# Altium schematic sheet SDram.SchDoc
size A4; Organization: Altium Limited; Address1: L3, 12a Rodborough Rd; Address2: Frenchs Forest; Address3: NSW; Address4: Australia 2086
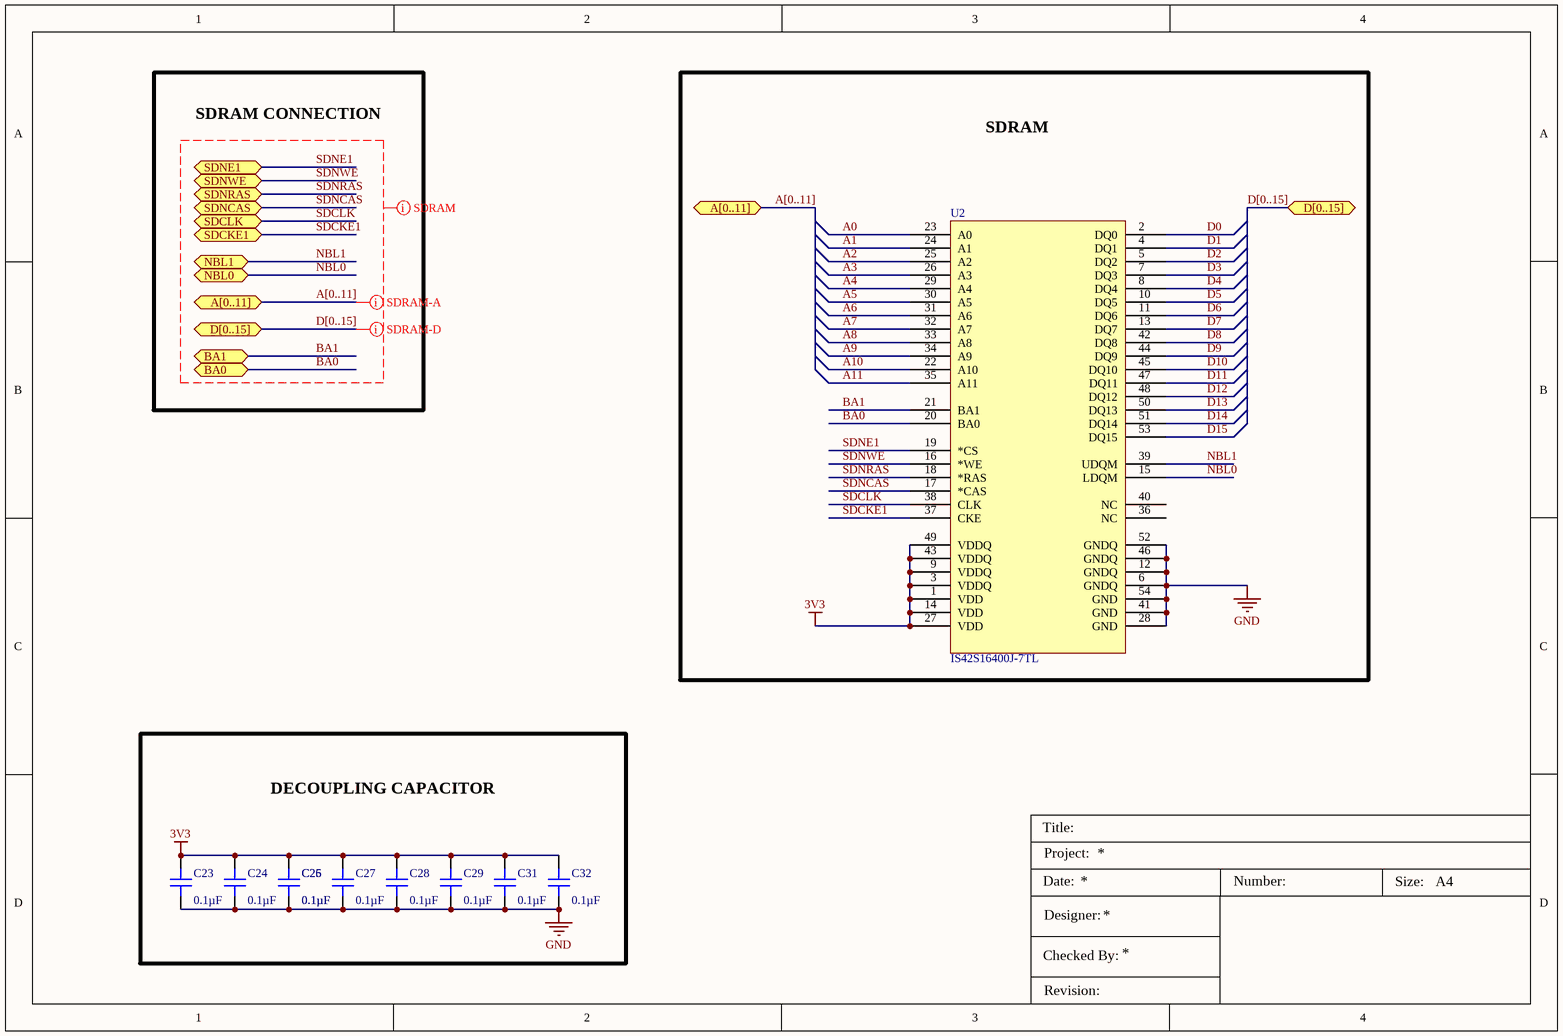
[diagram p0: SDram.SchDoc]

## Parts
C23  0.1µF  [CAP 0603_1608]
C24  0.1µF  [CAP 0603_1608]
C25  0.1µF  [CAP 0603_1608]
C26  0.1µF  [CAP 0603_1608]
C27  0.1µF  [CAP 0603_1608]
C28  0.1µF  [CAP 0603_1608]
C29  0.1µF  [CAP 0603_1608]
C31  0.1µF  [CAP 0603_1608]
C32  0.1µF  [CAP 0603_1608]
U2  IS42S16400J-7TL  [sdram]

## Blocks framed on the sheet
SDRAM: U2
DECOUPLING CAPACITOR: C23-C29 C31 C32

## Ports
A[0..11] (bidir), BA0 (bidir), BA1 (bidir), D[0..15] (bidir), NBL0 (bidir), NBL1 (bidir), SDCKE1 (bidir), SDCLK (bidir), SDNCAS (bidir), SDNE1 (bidir), SDNRAS (bidir), SDNWE (bidir)

## Nets
3V3: C23.2 C24.2 C25.2 C26.2 C27.2 C28.2 C29.2 C31.2 C32.2 U2.1(VDD) U2.3(VDDQ) U2.9(VDDQ) U2.14(VDD) U2.27(VDD) U2.43(VDDQ) U2.49(VDDQ)
GND: C23.1 C24.1 C25.1 C26.1 C27.1 C28.1 C29.1 C31.1 C32.1 U2.6(GNDQ) U2.12(GNDQ) U2.28(GND) U2.41(GND) U2.46(GNDQ) U2.52(GNDQ) U2.54(GND)
A0: U2.23(A0)
A1: U2.24(A1)
A2: U2.25(A2)
A3: U2.26(A3)
A4: U2.29(A4)
A5: U2.30(A5)
A6: U2.31(A6)
A7: U2.32(A7)
A8: U2.33(A8)
A9: U2.34(A9)
A10: U2.22(A10)
A11: U2.35(A11)
BA0: U2.20(BA0) ; port BA0
BA1: U2.21(BA1) ; port BA1
D0: U2.2(DQ0)
D1: U2.4(DQ1)
D2: U2.5(DQ2)
D3: U2.7(DQ3)
D4: U2.8(DQ4)
D5: U2.10(DQ5)
D6: U2.11(DQ6)
D7: U2.13(DQ7)
D8: U2.42(DQ8)
D9: U2.44(DQ9)
D10: U2.45(DQ10)
D11: U2.47(DQ11)
D12: U2.48(DQ12)
D13: U2.50(DQ13)
D14: U2.51(DQ14)
D15: U2.53(DQ15)
NBL0: U2.15(LDQM) ; port NBL0
NBL1: U2.39(UDQM) ; port NBL1
SDCKE1: U2.37(CKE) ; port SDCKE1
SDCLK: U2.38(CLK) ; port SDCLK
SDNCAS: U2.17(*CAS) ; port SDNCAS
SDNE1: U2.19(*CS) ; port SDNE1
SDNRAS: U2.18(*RAS) ; port SDNRAS
SDNWE: U2.16(*WE) ; port SDNWE

Not connected (* = marked no-connect by the designer): U2 36(NC) 40(NC)

## Buses and harness runs
bus A[0..11] = port A[0..11]
bus D[0..15] = port D[0..15]

## Layout directives
net class SDRAM: A[0..11], BA0, BA1, D[0..15], NBL0, NBL1, SDCKE1, SDCLK, SDNCAS, SDNE1, SDNRAS, SDNWE
net class SDRAM-A: A[0..11], BA0, BA1, D[0..15], NBL0, NBL1, SDCKE1, SDCLK, SDNCAS, SDNE1, SDNRAS, SDNWE
net class SDRAM-D: A[0..11], BA0, BA1, D[0..15], NBL0, NBL1, SDCKE1, SDCLK, SDNCAS, SDNE1, SDNRAS, SDNWE

## Notes on the sheet
- SDRAM CONNECTION
- Title:
- Project:
- Date:
- Designer:
- Number:
- Size:
- A4
- Checked By:
- Revision:

## Library data of the parts
C23-C29 C31 C32 = 6R3X14W104MV4T: CAP CER 0.1UF 6.3V X7R 0603; Part Number: 6R3X14W104MV4T; Value: 0.1µF
U2 = IS42S16400J-7TL: No Description AvailablSDRAM Memory IC 64Mb (4M x 16) Parallel 143 MHz 5.4 ns 54-TSOP IIe; Vendor: ISSI; Built_By: EMA_Cory; SourceLibrary: Add_to_database_2020-12-24; Datasheet: http://www.issi.com/WW/pdf/42-45S16400J.pdf; Manufacturer_Part_Number: IS42S16400J-7TL; Copyright: Copyright (C) 2018 Accelerated Designs. All rights reserved; RefDes: RefDes; Type: DEV; ComponentLink1Description: New link; ComponentLink1URL: https://www.digikey.be/en/products/detail/issi-integrated-silicon-solution-inc/IS42S16400J-7TL/2708623